# Altium schematic sheet Hall Effect IC.SchDoc
size A4; SheetNumber: 3; SheetTotal: 6
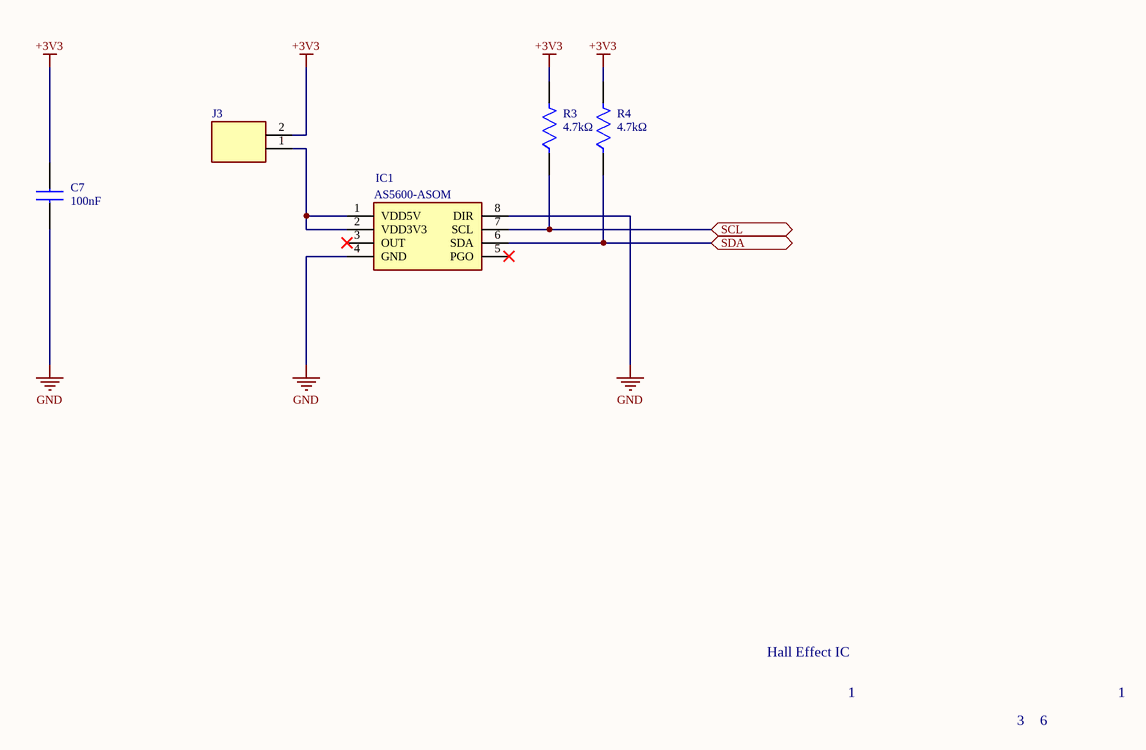
[diagram p0: Hall Effect IC.SchDoc]

## Parts
C7  value 100nF  [CAPC2013X137N]  (hidden comment: 0805B104K500NT)
IC1  AS5600-ASOM  [SOIC127P600X175-8N]
J3  87527-2  [HDRV2W66P0X254_1X2_467X244X1044P]  (value not drawn)
R3  value 4.7kΩ  [FP-RT0805-MFG]  (hidden comment: RT0805DRE074K7L)
R4  value 4.7kΩ  [FP-RT0805-MFG]  (hidden comment: RT0805DRE074K7L)

## Ports
SCL (bidir, see Encode Schematic[3B], Microcontroller[2B]), SDA (bidir, see Encode Schematic[3B], Microcontroller[2B])

## Nets
+3V3: C7.1 J3.2 R3.2 R4.2
GND: C7.2 IC1.4(GND) IC1.8(DIR)
SCL: IC1.7(SCL) R3.1 ; port SCL
SDA: IC1.6(SDA) R4.1 ; port SDA
NetIC1_1: IC1.1(VDD5V) IC1.2(VDD3V3) J3.1

Not connected (* = marked no-connect by the designer): IC1 3(OUT)* 5(PGO)*

## Notes on the sheet
- Hall Effect IC
- 1
- 3
- 6

## Library data of the parts
C7 = 0805B104K500NT: Capacitor; Manufacturer_Name: Novacap; Datasheet Link: https://componentsearchengine.com/Datasheets/1/0805B104K500NT.pdf; Height: 1.37mm; Manufacturer_Part_Number: 0805B104K500NT; Mouser Part Number: 767-0805B104K500NT; Mouser Price/Stock: https://www.mouser.com/Search/Refine.aspx?Keyword=767-0805B104K500NT
IC1 = AS5600-ASOM: Integrated Circuit; Manufacturer_Name: ams OSRAM; Datasheet Link: https://datasheet.datasheetarchive.com/originals/distributors/DKDS-11/214624.pdf; Height: 1.75mm; Manufacturer_Part_Number: AS5600-ASOM; Mouser Part Number: 985-AS5600-ASOM; Mouser Price/Stock: https://www.mouser.co.uk/ProductDetail/ams/AS5600-ASOM?qs=KTMMzrZdriG6aU1h9lJCUQ%3D%3D; Arrow Part Number: AS5600-ASOM; Arrow Price/Stock: https://www.arrow.com/en/products/as5600-asom/ams-ag?region=nac
J3 = 87527-2: Power isolation jumper; Manufacturer_Name: TE Connectivity; Datasheet Link: https://www.te.com/commerce/DocumentDelivery/DDEController?Action=showdoc&DocId=Customer+Drawing%7F87527%7FH%7Fpdf%7FEnglish%7FENG_CD_87527_H.pdf%7F87527-2; Height: 10.439mm; Manufacturer_Part_Number: 87527-2; Mouser Part Number: 571-875272; Mouser Price/Stock: https://www.mouser.co.uk/ProductDetail/TE-Connectivity/87527-2?qs=ZDXmSm13593hsB4j%252B6gMfg%3D%3D; Arrow Part Number: 87527-2; Arrow Price/Stock: https://www.arrow.com/en/products/87527-2/te-connectivity?region=nac
R3 R4 = CMP-03412-005354-1: RES SMD 4.7K OHM 0.5% 1/8W 0805; Manufacturer: Yageo; Power Rating: 0.125W; Tolerance: 0.01; Voltage Rating: 150V; Description: RT0805 4.7KΩ 0.125W 50 ppm/°C 1.00%; Temperature Coefficient: 50 ppm/°C; Lead Free: Yes; Device Class L2: Resistors; ComponentLink2Description: Datasheet; RoHS: TRUE; Package: RT0805; Resistance: 4.7KΩ; Device Class L3: Chip SMD Resistors; Ipc Land Pattern Name: RESC200125X50; Category: Res; Octopart: https://octopart.com/rt0805dre074k7l-yageo-1242027; Temperature: -55°C to +155°C; Temperature Range High: +155°C; Digikey Description: RES SMD 4.7K OHM 0.5% 1/8W 0805; Series: RT; Height: 0.6mm; Footprint Url: http://www.yageo.com/exep/pages/download/literatures/PYu-R_Mount_10.pdf; Device Class L1: Passive Components; Temperature Range Low: -55°C; Composition: Thin Film; Manufacturer Part Number: RT0805DRE074K7L; ComponentLink2URL: http://www.yageo.com/documents/recent/PYu-RT_1-to-0.01_RoHS_L_9.pdf; Automotive: No